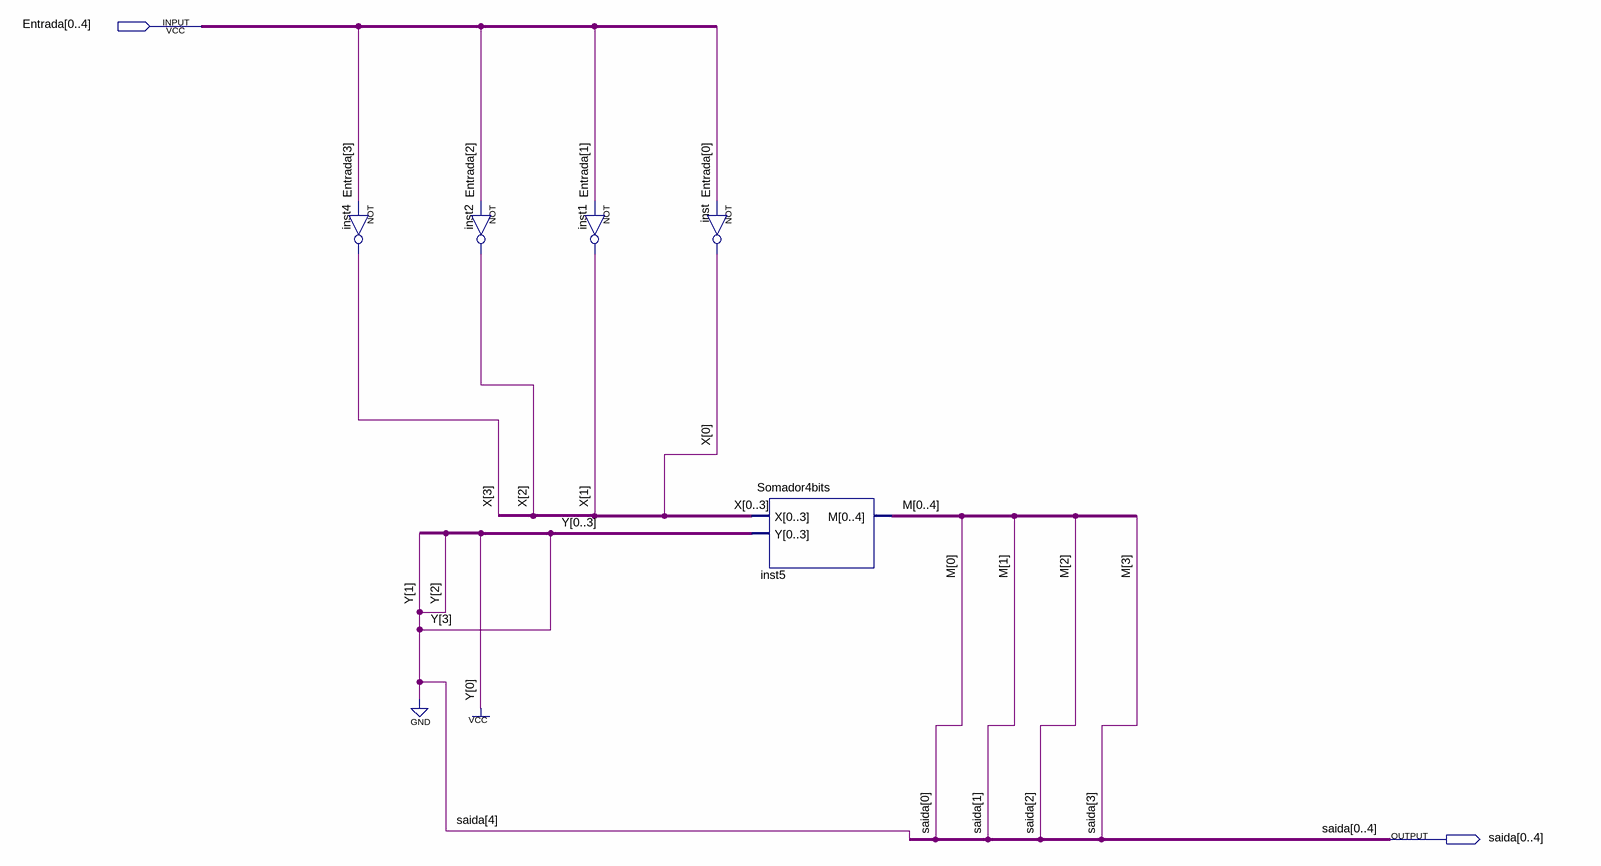
[diagram p0: schematic sheet]
// Quartus schematic Comp2.bdf as structural Verilog: 5 symbols, 2 pins
module Comp2 (
  input  [0:4] Entrada,
  output [0:4] saida
);

  wire [3:0] X;
  wire [4:4] M;

  not inst4 (X[3], Entrada[3]);
  not inst2 (X[2], Entrada[2]);
  not inst1 (X[1], Entrada[1]);
  not inst (X[0], Entrada[0]);
  Somador4bits inst5 (.X({X[0], X[1], X[2], X[3]}), .Y(4'b1000), .M({saida[0:3], M[4]}));

  assign saida[4] = 1'b0;

  // Other names for the same wires on the sheet: M[3:0] = {saida[3], saida[2], saida[1], saida[0]}
endmodule
